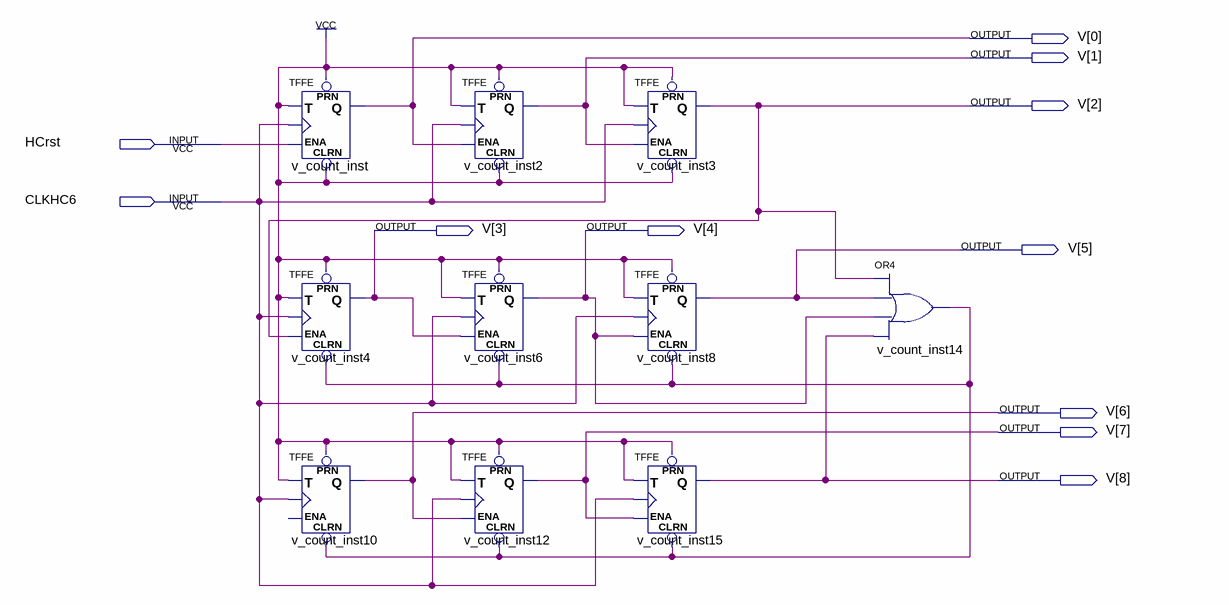
[diagram p0: schematic sheet]
// Quartus schematic ula_v_counter.bdf as structural Verilog: 10 symbols, 11 pins
module ula_v_counter (
  input  HCrst,
  input  CLKHC6,
  output [8:0] V
);

  wire v_count_inst14_out;

  TFFE v_count_inst (.CLRN(1'b1), .T(1'b1), .CLK(CLKHC6), .ENA(HCrst), .PRN(1'b1), .Q(V[0]));
  TFFE v_count_inst4 (.CLRN(v_count_inst14_out), .T(1'b1), .CLK(CLKHC6), .ENA(V[2]), .PRN(1'b1), .Q(V[3]));
  TFFE v_count_inst10 (.CLRN(v_count_inst14_out), .T(1'b1), .CLK(CLKHC6), .PRN(1'b1), .Q(V[6]));  // open: ENA
  TFFE v_count_inst2 (.CLRN(1'b1), .T(1'b1), .CLK(CLKHC6), .ENA(V[0]), .PRN(1'b1), .Q(V[1]));
  TFFE v_count_inst6 (.CLRN(v_count_inst14_out), .T(1'b1), .CLK(CLKHC6), .ENA(V[3]), .PRN(1'b1), .Q(V[4]));
  TFFE v_count_inst12 (.CLRN(v_count_inst14_out), .T(1'b1), .CLK(CLKHC6), .ENA(V[6]), .PRN(1'b1), .Q(V[7]));
  TFFE v_count_inst3 (.CLRN(1'b1), .T(1'b1), .CLK(CLKHC6), .ENA(V[1]), .PRN(1'b1), .Q(V[2]));
  TFFE v_count_inst8 (.CLRN(v_count_inst14_out), .T(1'b1), .CLK(CLKHC6), .ENA(V[4]), .PRN(1'b1), .Q(V[5]));
  TFFE v_count_inst15 (.CLRN(v_count_inst14_out), .T(1'b1), .CLK(CLKHC6), .ENA(V[7]), .PRN(1'b1), .Q(V[8]));
  or v_count_inst14 (v_count_inst14_out, V[2], V[5], V[4], V[8]);
endmodule
